# Altium project PWM DC Motor Controller.PrjPcb
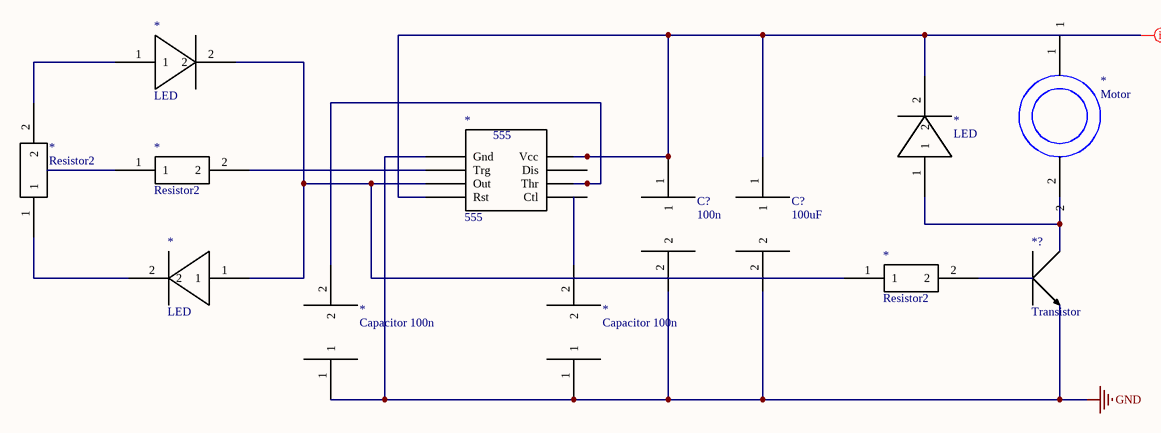
[diagram p0: Sheet1.SchDoc]
1 sheet, 13 parts. Net scope: global (net labels, ports and power ports of the same name join across sheets).
Board file: PCB1.PcbDoc

## Sheet Sheet1.SchDoc
size A4; SheetNumber: 1; SheetTotal: 1

### Parts
555  555  [555]
*?  Transistor  [TRANSISTOR]
C1  Capacitor 100n  [Polarized Capacitor]
C2  100n  [Polarized Capacitor]
C3  100uF  [Polarized Capacitor]
C4  Capacitor 100n  [Polarized Capacitor]
D1  LED  [Diode]
D2  LED  [Diode]
D3  LED  [Diode]
M1  Motor  [Motor]
R1  Resistor2  [Resistor 1]
R2  Resistor2  [Resistor 1]
VR1  Resistor2  [Resistor 1]

### Nets
GND: 555.?1(Gnd) C1.1 C2.2 C3.2 C4.1
Net555_?2: 555.?2(Trg) R1.2
Net555_?3: 555.?3(Out) D2.2 D3.1 R2.1
Net555_?4: 555.?4(Rst) 555.?5(Vcc) C2.1 C3.1 D1.2
Net555_?7: 555.?7(Thr) C1.2
NetD2_1: D2.1 VR1.2
NetD3_2: D3.2 VR1.1

Not connected (* = marked no-connect by the designer): 555 ?6(Dis) ?8(Ctl); C4 2; D1 1; M1 1 2; R1 1; R2 2

### Layout directives
mark named 12v: Net555_?4

### Library data of the parts
C1 C4 = Capacitor 1
C2 C3 = Capacitor